# Altium schematic sheet USB-RS232_Schematic.SchDoc: USB-RS232
size 420 x 297 mm; ApprovedBy: Рогов; CheckedBy: Королев Д.М.; DrawnBy: Антонов И.Д.; DocumentNumber: Введите номер платы + Э3; SheetTotal: 1; DocumentType: Электрическая принципиальная; Format: A3; ImagePath: Введите номер платы
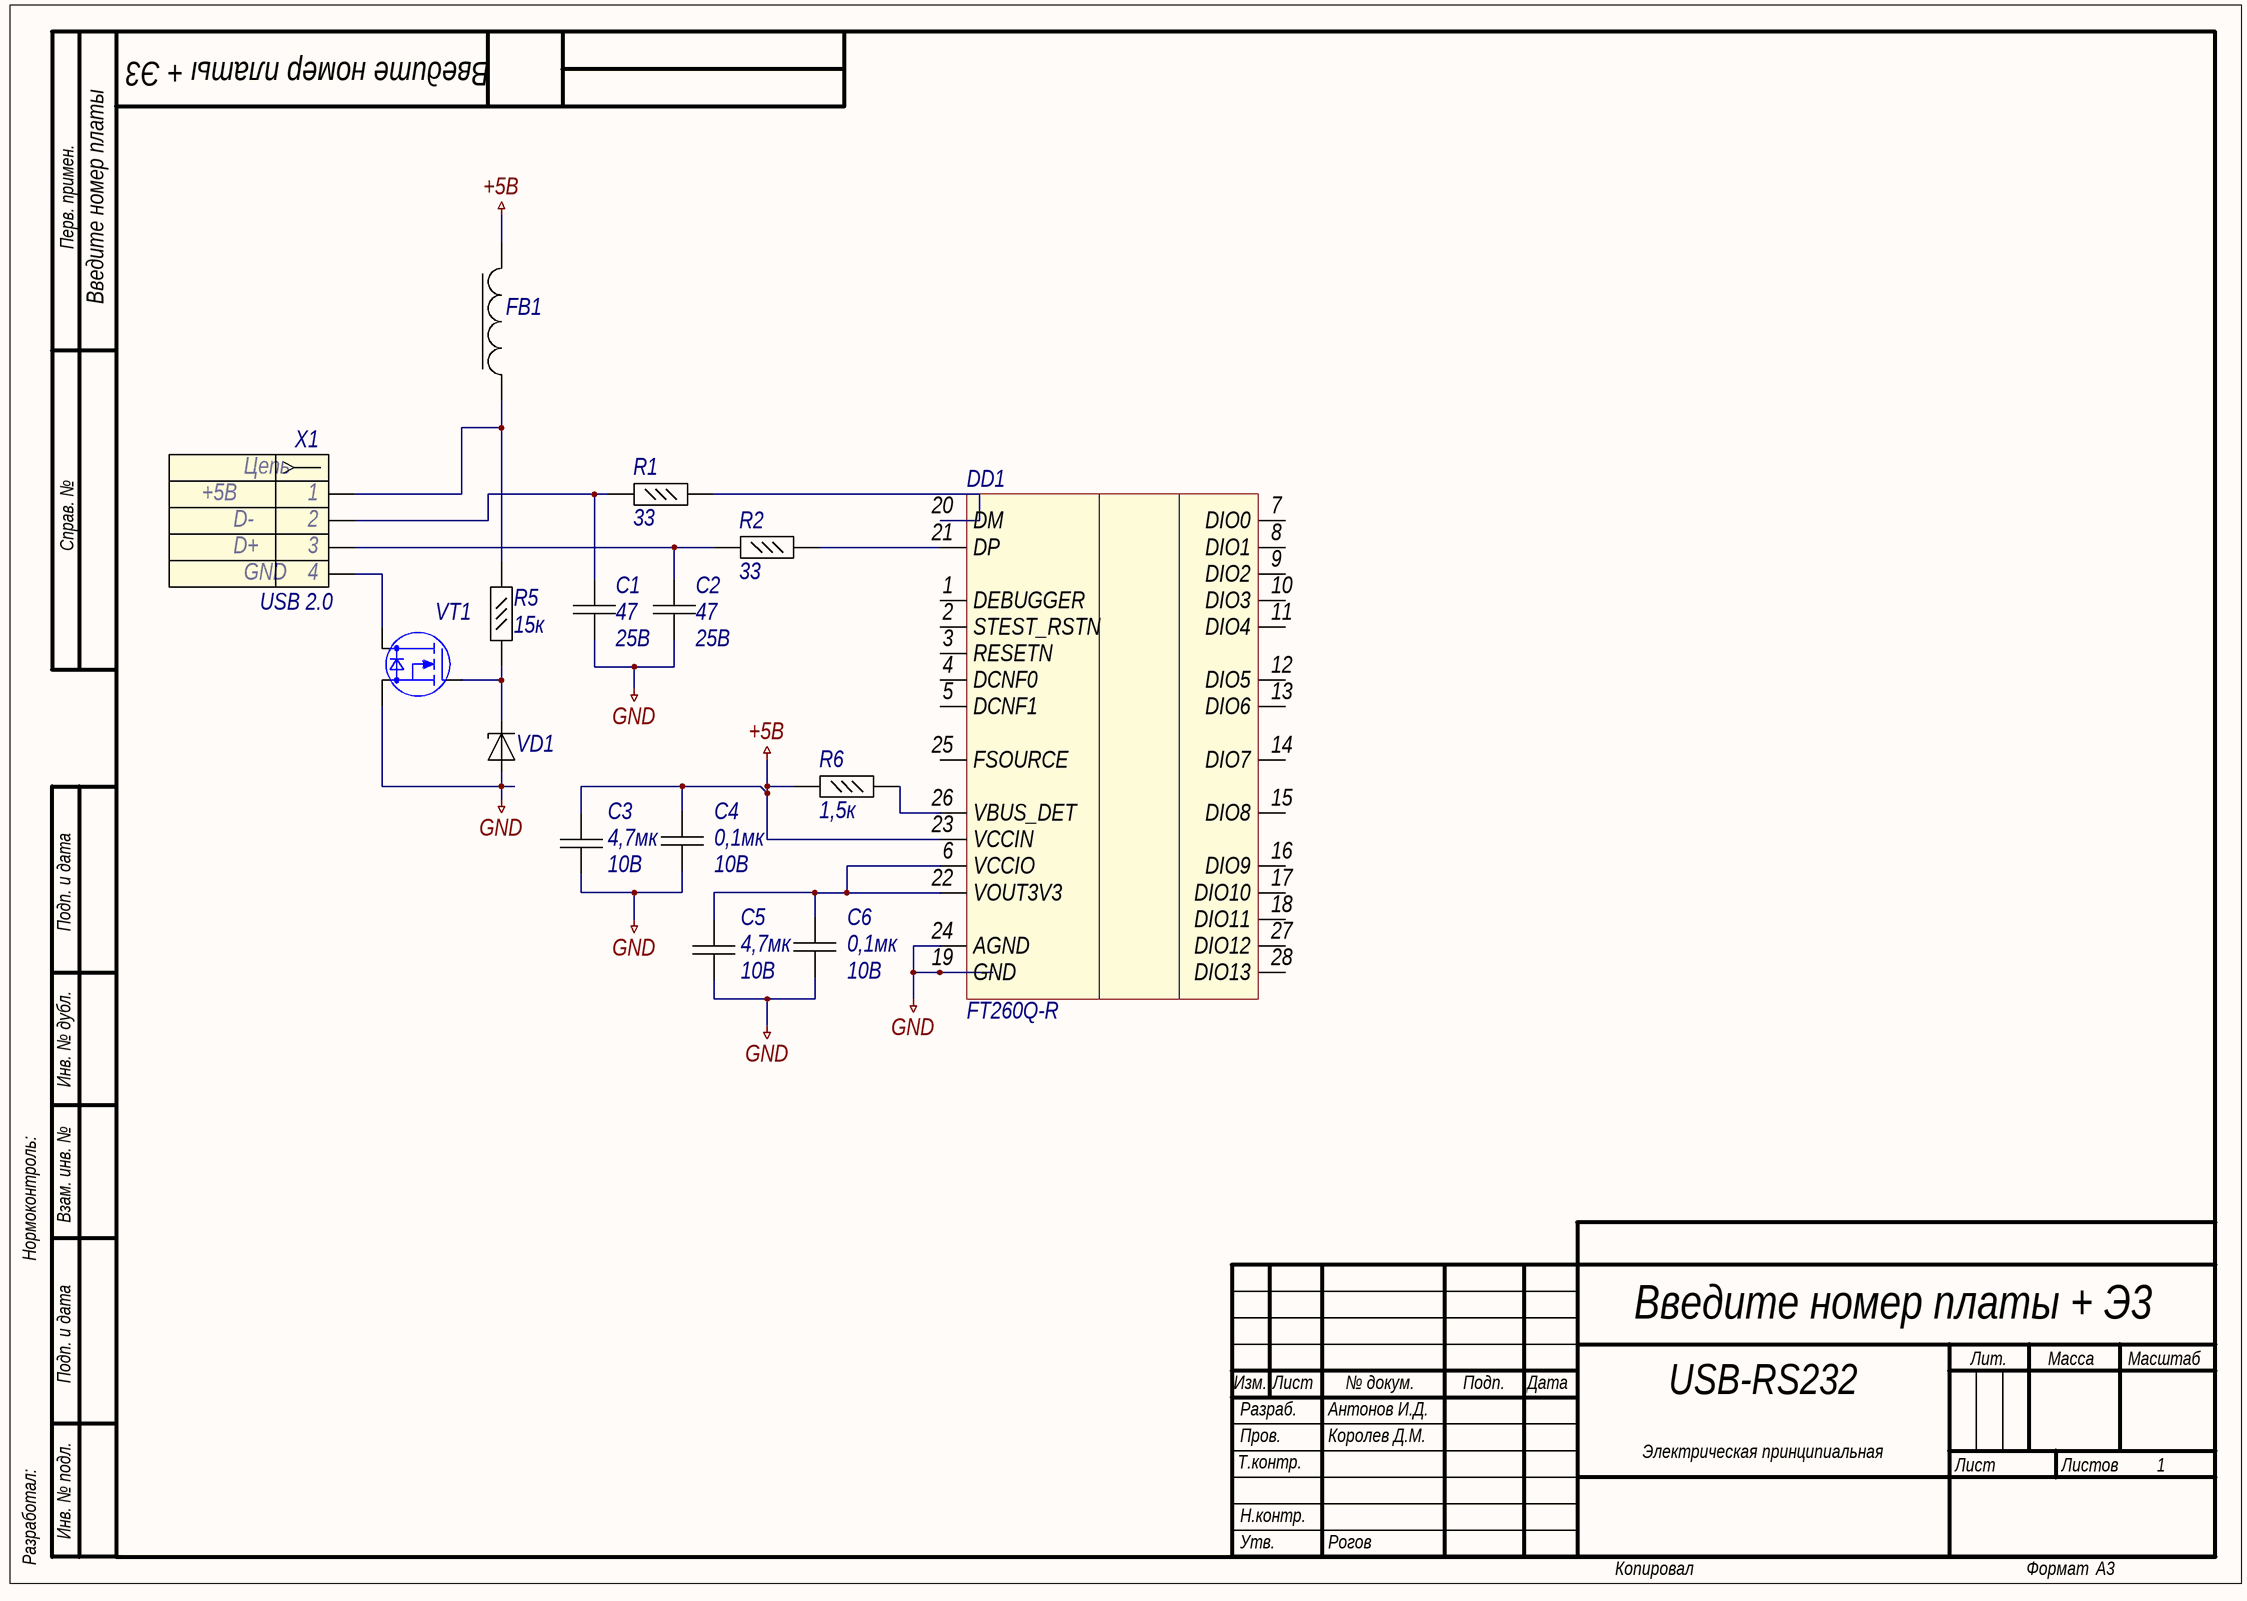
[diagram p0: USB-RS232_Schematic.SchDoc]

## Parts
C1  Voltage: 25В  Capacitance: 47  [CH0201C]  (hidden comment: Capacitor)
C2  Voltage: 25В  Capacitance: 47  [CH0201C]  (hidden comment: Capacitor)
C3  Voltage: 10В  Capacitance: 4,7мк  [CH0402C]  (hidden comment: Capacitor)
C4  Voltage: 10В  Capacitance: 0,1мк  [CH0402C]  (hidden comment: Capacitor)
C5  Voltage: 10В  Capacitance: 4,7мк  [CH0402C]  (hidden comment: Capacitor)
C6  Voltage: 10В  Capacitance: 0,1мк  [CH0402C]  (hidden comment: Capacitor)
DD1  FT260Q-R  [FT260-Q]
FB1  Ferrite bead  [CH0805F]  (value not drawn)
R1  Resistance: 33  [CH0201R]  (hidden comment: Res_0.05)
R2  Resistance: 33  [CH0201R]  (hidden comment: Res_0.05)
R5  Resistance: 15к  [CH0201R]  (hidden comment: Res_0.05)
R6  Resistance: 1,5к  [CH0201R]  (hidden comment: Res_0.05)
VD1  BZT52H-C7V5,115  [SOD123F]  (value not drawn)
VT1  N-MOSFET  [DMP1200UFR47]  (value not drawn)
X1  USB 2.0  Vcc: +5В  [USB]

## Nets
+5В: C3.11(C1+) C4.11(C1+) DD1.23(VCCIN) FB1.14 R6.9(C1-)
GND: C1.11(C1+) C2.11(C1+) C3.11(C1-) C4.11(C1-) C5.11(C1-) C6.11(C1-) DD1.19(GND) DD1.24(AGND) VD1.1(A) VT1.2(S)
NetC1_11: C1.11(C1-) R1.9(C1-) X1.2
NetC2_11: C2.11(C1-) R2.9(C1-) X1.3
NetC5_11: C5.11(C1+) C6.11(C1+) DD1.6(VCCIO) DD1.22(VOUT3V3)
NetDD1_20: DD1.20(DM) R1.10(C1-)
NetDD1_21: DD1.21(DP) R2.10(C1-)
NetDD1_26: DD1.26(VBUS_DET) R6.10(C1-)
NetFB1_13: FB1.13(C1-) R5.10(C1-) X1.1
NetR5_9: R5.9(C1-) VD1.2(C) VT1.1(G)
NetVT1_3: VT1.3(D) X1.4

Not connected (* = marked no-connect by the designer): DD1 1(DEBUGGER) 2(STEST_RSTN) 3(RESETN) 4(DCNF0) 5(DCNF1) 7(DIO0) 8(DIO1) 9(DIO2) 10(DIO3) 11(DIO4) 12(DIO5) 13(DIO6) 14(DIO7) 15(DIO8) 16(DIO9) 17(DIO10) 18(DIO11) 25(FSOURCE) 27(DIO12) 28(DIO13)

## Notes on the sheet
- Перв. примен.
- Справ. №
- Подп. и дата
- Инв. № дубл.
- Нормоконтроль:
- Взам. инв. №
- Изм.
- Лист
- № докум.
- Подп.
- Дата
- Лит.
- Масса
- Масштаб
- Т.контр.
- Пров.
- Разраб.
- Листов
- Разработал:
- Инв. № подл.
- Н.контр.
- Утв.
- Копировал
- Формат
- (in symbol USB-A) Цепь; D-; D+; GND

## Library data of the parts
C1 C2 = Capacitor: Manufacture: TDK; Model: CGA1A2C0G1E470J030BA; Case: 0201; HelpURL: https://ru.mouser.com/ProductDetail/TDK/CGA1A2C0G1E470J030BA?qs=LcTL%2f5vFEzGP84WOj%2f5Msw==&utm_source=netcomponents&utm_medium=aggregator&utm_campaign=CGA1A2C0G1E470J030BA&utm_term=CGA1A2C0G1E470J030BA&utm_content=TDK
C3 C5 = Capacitor: Manufacture: Murata Electronics; Model: ZRB15XR61A475KE01D; Case: 0402; HelpURL: https://ru.mouser.com/ProductDetail/Murata-Electronics/ZRB15XR61A475KE01D?qs=sGAEpiMZZMs0AnBnWHyRQO9VYadaKTO%252beZnE9zFUsbv4FmCibz4ZfQ%3d%3d
C4 C6 = Capacitor: Manufacture: AVX; Model: 0402ZD103KAT2A; Case: 0402; HelpURL: https://ru.mouser.com/ProductDetail/AVX/0402ZD103KAT2A?qs=sGAEpiMZZMs0AnBnWHyRQKdiqyDPVQdAu74W%2fwwRq8A%3d
DD1 = FT260Q-R: IC BRIDGE USB TO UART/I2C 28WQFN; Manufacture: FTDI, Future Technology Devices International Ltd; Model: FT260Q-R; Case: 28-WQFN (5x5); HelpURL: https://www.digikey.com/product-detail/en/ftdi-future-technology-devices-international-ltd/FT260Q-R/FT260Q-RTR-ND/5956531
FB1 = Ferrite bead: Manufacture: Laird; Model: MI0805K400R-10; Max DC current: 1,5 А; Impedance: 40; Case: 0805; HekpURL: https://ru.mouser.com/ProductDetail/Laird/MI0805K400R-10?qs=%2fha2pyFaduiHND%252bdjhHwYezPllDM7l6y0ARhTY4M0iGJeUtz%252byGA0A%3d%3d
R1 R2 = Res_0.05: Manufacture: Yageo; Model: RC0201JR-7D33RL; Case: 0201; HelpURL: https://ru.mouser.com/ProductDetail/Yageo/RC0201JR-7D33RL?qs=sGAEpiMZZMvdGkrng054t7z4BkURc4Lz%252bmllNN9%252bKbhAThDcaEXWTA%3d%3d
R5 = Res_0.05: Manufacture: Yageo; Model: RC0201JR-7D15KL; Case: 0201; HelpURL: https://ru.mouser.com/ProductDetail/Yageo/RC0201FR-7D15KL?qs=sGAEpiMZZMvdGkrng054twOk7UJM2yUKInQKj8UO6ZIKaB18xvYGZw%3d%3d
R6 = Res_0.05: Manufacture: Yageo; Model: RC0201JR-7D1K5L; Case: 0201; HelpURL: https://ru.mouser.com/ProductDetail/Yageo/RC0201JR-7D1K5L?qs=sGAEpiMZZMvdGkrng054t7z4BkURc4LzDkbQLqMidIc7NEWN7G0wuA%3d%3d
VD1 = Diod Zener: Manufacturer: Nexperia; Zener Voltage: 7.9 В; Zener Current: 250 мА; Model: BZT52H-C7V5,115; HelpURL: https://ru.mouser.com/ProductDetail/Nexperia/BZT52H-C7V5115?qs=sGAEpiMZZMtQ8nqTKtFS%2fMB%2fC95zni11dS7M9892xcw%3d
VT1 = trans2: Part Number: DMN1045UFR4-7; Manufacturer: Diodes Incorporated; Structure: n-channel; V drain-source max: 12 В; Rds: 0,025; Gate-to-source voltage: 8 В; Continuous drain current: 3.2 А; Pulsed drain current: 7,4A; Power dissipation: 1.26 Вт; Gate-Source Threshold Voltage: 0,4 В; HelpURL: https://ru.mouser.com/ProductDetail/Diodes-Incorporated/DMN1045UFR4-7?qs=sGAEpiMZZMshyDBzk1%2fWi0dsXOGve85xKEZgtfcBx9SSf%2f6qwJJ3sQ%3d%3d
X1 = USB-A: USB; Manufacturer: TE Connectivity; Model: 292303-2; HelpURL: https://www.digikey.com/product-detail/en/te-connectivity-amp-connectors/292303-2/A105221-ND/953990; ComponentKind: type A